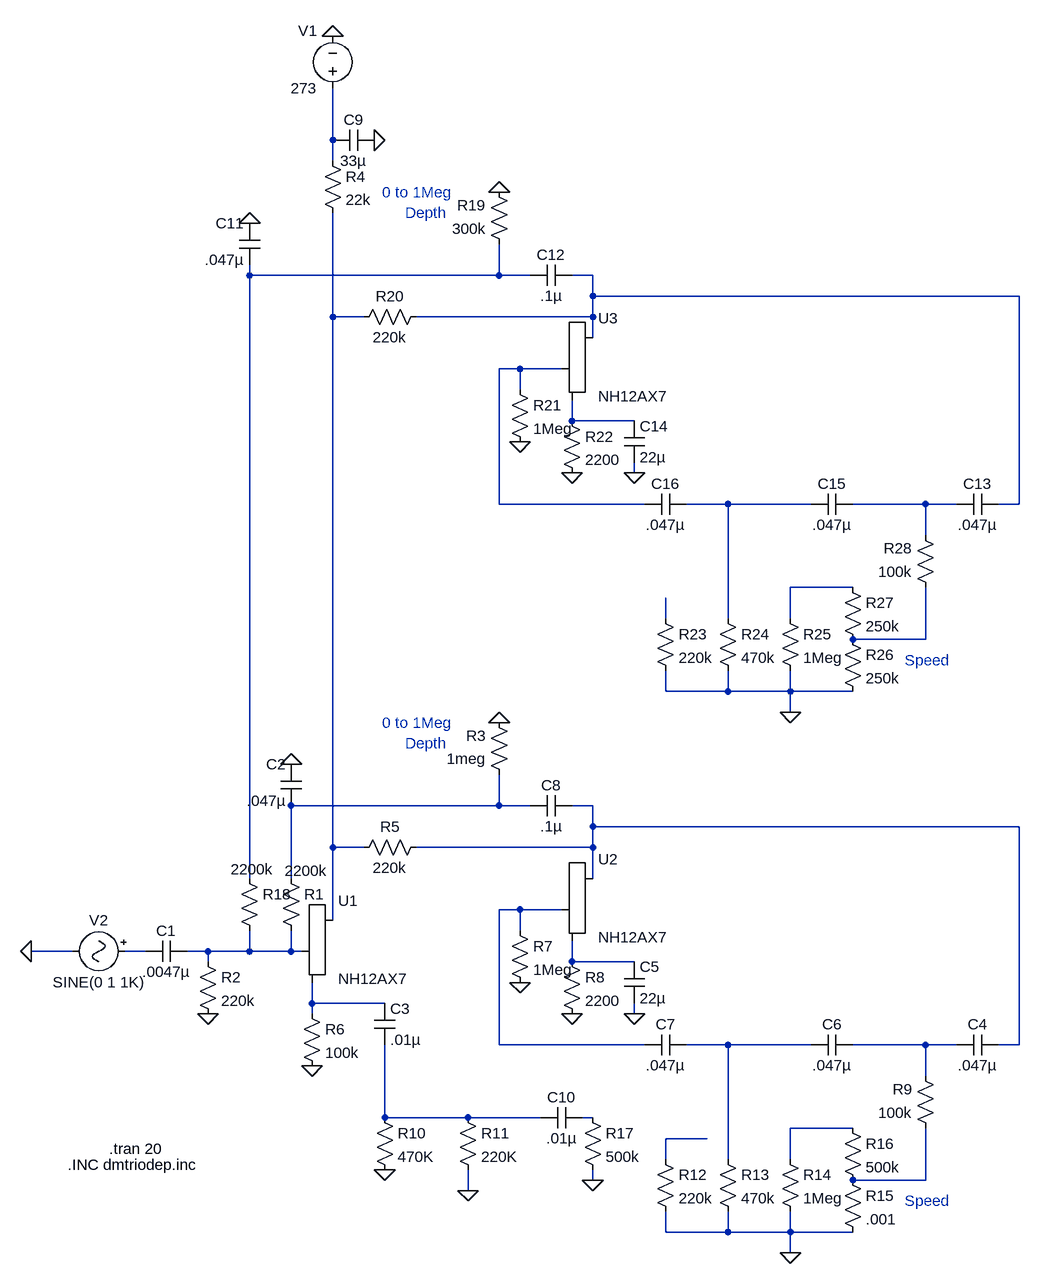
[diagram p0: schematic Matchless_Tremolo_double_tremolo.asc]
Matchless_Tremolo_double_tremolo.asc, the LTspice schematic file:
Version 4
SHEET 1 1108 696
WIRE 48 -1072 48 -1152
WIRE 48 -1040 48 -1072
WIRE -80 -864 -80 -880
WIRE 304 -864 304 -912
WIRE 304 -864 -80 -864
WIRE 352 -864 304 -864
WIRE 448 -864 416 -864
WIRE 448 -832 448 -864
WIRE 1104 -832 448 -832
WIRE 48 -800 48 -960
WIRE 96 -800 48 -800
WIRE 448 -800 448 -832
WIRE 448 -800 176 -800
WIRE 448 -768 448 -800
WIRE 336 -720 304 -720
WIRE 400 -720 336 -720
WIRE 336 -688 336 -720
WIRE 416 -640 416 -672
WIRE 512 -640 416 -640
WIRE 512 -560 512 -576
WIRE 304 -512 304 -720
WIRE 528 -512 304 -512
WIRE 656 -512 592 -512
WIRE 784 -512 656 -512
WIRE 960 -512 848 -512
WIRE 1008 -512 960 -512
WIRE 1104 -512 1104 -832
WIRE 1104 -512 1072 -512
WIRE 960 -464 960 -512
WIRE 848 -384 752 -384
WIRE 560 -336 560 -368
WIRE 656 -336 656 -512
WIRE 752 -336 752 -384
WIRE 960 -304 960 -384
WIRE 960 -304 848 -304
WIRE 560 -224 560 -256
WIRE 656 -224 656 -256
WIRE 656 -224 560 -224
WIRE 752 -224 752 -256
WIRE 752 -224 656 -224
WIRE 848 -224 752 -224
WIRE 752 -192 752 -224
WIRE 304 -48 304 -96
WIRE 304 -48 -16 -48
WIRE 352 -48 304 -48
WIRE 448 -48 416 -48
WIRE 448 -16 448 -48
WIRE 1104 -16 448 -16
WIRE 48 16 48 -800
WIRE 96 16 48 16
WIRE 448 16 448 -16
WIRE 448 16 176 16
WIRE -80 64 -80 -864
WIRE -16 64 -16 -48
WIRE 448 64 448 16
WIRE 336 112 304 112
WIRE 400 112 336 112
WIRE 48 128 48 16
WIRE 336 144 336 112
WIRE -352 176 -416 176
WIRE -240 176 -272 176
WIRE -144 176 -176 176
WIRE -80 176 -80 144
WIRE -80 176 -144 176
WIRE -16 176 -16 144
WIRE -16 176 -80 176
WIRE 0 176 -16 176
WIRE -144 192 -144 176
WIRE 416 192 416 160
WIRE 512 192 416 192
WIRE 16 256 16 224
WIRE 128 256 16 256
WIRE 16 272 16 256
WIRE 512 272 512 256
WIRE 304 320 304 112
WIRE 528 320 304 320
WIRE 656 320 592 320
WIRE 784 320 656 320
WIRE 960 320 848 320
WIRE 1008 320 960 320
WIRE 1104 320 1104 -16
WIRE 1104 320 1072 320
WIRE 960 368 960 320
WIRE 128 432 128 320
WIRE 256 432 128 432
WIRE 368 432 256 432
WIRE 448 432 432 432
WIRE 848 448 752 448
WIRE 624 464 560 464
WIRE 560 496 560 464
WIRE 656 496 656 320
WIRE 752 496 752 448
WIRE 448 528 448 512
WIRE 960 528 960 448
WIRE 960 528 848 528
WIRE 256 544 256 512
WIRE 560 608 560 576
WIRE 656 608 656 576
WIRE 656 608 560 608
WIRE 752 608 752 576
WIRE 752 608 656 608
WIRE 848 608 752 608
WIRE 752 640 752 608
FLAG 48 -1232 0
FLAG -144 272 0
FLAG -16 -112 0
FLAG 304 -176 0
FLAG 16 352 0
FLAG 512 272 0
FLAG 416 272 0
FLAG 128 512 0
FLAG 256 544 0
FLAG 336 224 0
FLAG -416 176 0
FLAG 112 -1072 0
FLAG 752 640 0
FLAG 448 528 0
FLAG -80 -944 0
FLAG 304 -992 0
FLAG 512 -560 0
FLAG 416 -560 0
FLAG 336 -608 0
FLAG 752 -192 0
SYMBOL voltage 48 -1136 R180
WINDOW 0 24 104 Left 0
WINDOW 3 24 16 Left 0
WINDOW 123 0 0 Left 0
WINDOW 39 0 0 Left 0
SYMATTR InstName V1
SYMATTR Value 273
SYMBOL cap -176 160 R90
WINDOW 0 0 32 VBottom 0
WINDOW 3 32 32 VTop 0
SYMATTR InstName C1
SYMATTR Value .0047µ
SYMBOL res -32 48 R0
WINDOW 3 6 4 Left 0
SYMATTR InstName R1
SYMATTR Value 2200k
SYMBOL res -160 176 R0
SYMATTR InstName R2
SYMATTR Value 220k
SYMBOL cap 0 -48 R180
WINDOW 0 24 64 Left 0
WINDOW 3 24 8 Left 0
SYMATTR InstName C2
SYMATTR Value .047µ
SYMBOL res 320 -80 R180
WINDOW 0 36 76 Left 0
WINDOW 3 36 40 Left 0
SYMATTR InstName R3
SYMATTR Value 1meg
SYMBOL Misc\\triode 48 176 R0
SYMATTR InstName U1
SYMATTR Value NH12AX7
SYMBOL res 192 0 R90
WINDOW 0 0 56 VBottom 0
WINDOW 3 32 56 VTop 0
SYMATTR InstName R5
SYMATTR Value 220k
SYMBOL res 0 256 R0
SYMATTR InstName R6
SYMATTR Value 100k
SYMBOL cap 112 256 R0
SYMATTR InstName C3
SYMATTR Value .01µ
SYMBOL Misc\\triode 448 112 R0
SYMATTR InstName U2
SYMATTR Value NH12AX7
SYMBOL res 320 128 R0
SYMATTR InstName R7
SYMATTR Value 1Meg
SYMBOL cap 1072 304 R90
WINDOW 0 0 32 VBottom 0
WINDOW 3 32 32 VTop 0
SYMATTR InstName C4
SYMATTR Value .047µ
SYMBOL cap 496 192 R0
SYMATTR InstName C5
SYMATTR Value 22µ
SYMBOL res 400 176 R0
SYMATTR InstName R8
SYMATTR Value 2200
SYMBOL cap 848 304 R90
WINDOW 0 0 32 VBottom 0
WINDOW 3 32 32 VTop 0
SYMATTR InstName C6
SYMATTR Value .047µ
SYMBOL res 976 464 R180
WINDOW 0 36 76 Left 0
WINDOW 3 36 40 Left 0
SYMATTR InstName R9
SYMATTR Value 100k
SYMBOL cap 592 304 R90
WINDOW 0 0 32 VBottom 0
WINDOW 3 32 32 VTop 0
SYMATTR InstName C7
SYMATTR Value .047µ
SYMBOL res 112 416 R0
SYMATTR InstName R10
SYMATTR Value 470K
SYMBOL res 240 416 R0
SYMATTR InstName R11
SYMATTR Value 220K
SYMBOL res 544 480 R0
SYMATTR InstName R12
SYMATTR Value 220k
SYMBOL res 640 480 R0
SYMATTR InstName R13
SYMATTR Value 470k
SYMBOL res 736 480 R0
SYMATTR InstName R14
SYMATTR Value 1Meg
SYMBOL res 832 512 R0
SYMATTR InstName R15
SYMATTR Value .001
SYMBOL res 832 432 R0
SYMATTR InstName R16
SYMATTR Value 500k
SYMBOL cap 416 -64 R90
WINDOW 0 0 32 VBottom 0
WINDOW 3 32 32 VTop 0
SYMATTR InstName C8
SYMATTR Value .1µ
SYMBOL res 32 -1056 R0
SYMATTR InstName R4
SYMATTR Value 22k
SYMBOL cap 112 -1088 R90
WINDOW 0 0 32 VBottom 0
WINDOW 3 32 32 VTop 0
SYMATTR InstName C9
SYMATTR Value 33µ
SYMBOL Misc\\signal -256 176 R90
WINDOW 0 -32 56 VBottom 0
WINDOW 3 32 56 VTop 0
SYMATTR InstName V2
SYMBOL cap 432 416 R90
WINDOW 0 0 32 VBottom 0
WINDOW 3 32 32 VTop 0
SYMATTR InstName C10
SYMATTR Value .01µ
SYMBOL res 432 416 R0
SYMATTR InstName R17
SYMATTR Value 500k
SYMBOL res -96 48 R0
WINDOW 3 -13 2 Left 0
SYMATTR InstName R18
SYMATTR Value 2200k
SYMBOL cap -64 -880 R180
WINDOW 0 24 64 Left 0
WINDOW 3 24 8 Left 0
SYMATTR InstName C11
SYMATTR Value .047µ
SYMBOL res 320 -896 R180
WINDOW 0 36 76 Left 0
WINDOW 3 36 40 Left 0
SYMATTR InstName R19
SYMATTR Value 300k
SYMBOL res 192 -816 R90
WINDOW 0 0 56 VBottom 0
WINDOW 3 32 56 VTop 0
SYMATTR InstName R20
SYMATTR Value 220k
SYMBOL cap 416 -880 R90
WINDOW 0 0 32 VBottom 0
WINDOW 3 32 32 VTop 0
SYMATTR InstName C12
SYMATTR Value .1µ
SYMBOL Misc\\triode 448 -720 R0
SYMATTR InstName U3
SYMATTR Value NH12AX7
SYMBOL res 320 -704 R0
SYMATTR InstName R21
SYMATTR Value 1Meg
SYMBOL cap 1072 -528 R90
WINDOW 0 0 32 VBottom 0
WINDOW 3 32 32 VTop 0
SYMATTR InstName C13
SYMATTR Value .047µ
SYMBOL cap 496 -640 R0
SYMATTR InstName C14
SYMATTR Value 22µ
SYMBOL res 400 -656 R0
SYMATTR InstName R22
SYMATTR Value 2200
SYMBOL cap 848 -528 R90
WINDOW 0 0 32 VBottom 0
WINDOW 3 32 32 VTop 0
SYMATTR InstName C15
SYMATTR Value .047µ
SYMBOL cap 592 -528 R90
WINDOW 0 0 32 VBottom 0
WINDOW 3 32 32 VTop 0
SYMATTR InstName C16
SYMATTR Value .047µ
SYMBOL res 544 -352 R0
SYMATTR InstName R23
SYMATTR Value 220k
SYMBOL res 640 -352 R0
SYMATTR InstName R24
SYMATTR Value 470k
SYMBOL res 736 -352 R0
SYMATTR InstName R25
SYMATTR Value 1Meg
SYMBOL res 832 -320 R0
SYMATTR InstName R26
SYMATTR Value 250k
SYMBOL res 832 -400 R0
SYMATTR InstName R27
SYMATTR Value 250k
SYMBOL res 976 -368 R180
WINDOW 0 36 76 Left 0
WINDOW 3 36 40 Left 0
SYMATTR InstName R28
SYMATTR Value 100k
TEXT 224 -144 Right 0 ;Depth
TEXT 928 560 Left 0 ;Speed
TEXT -360 504 Left 0 !.INC dmtriodep.inc
TEXT -296 480 Left 0 !.tran 20
TEXT 232 -176 Right 0 ;0 to 1Meg
TEXT 224 -960 Right 0 ;Depth
TEXT 232 -992 Right 0 ;0 to 1Meg
TEXT 928 -272 Left 0 ;Speed

The netlist it stands for:
* Matchless_Tremolo_double_tremolo.asc
V1 N001 0 273
C1 N016 N015 .0047µ
R1 N012 N016 2200k
R2 N016 0 220k
C2 N012 0 .047µ
R3 N012 0 1meg
XU1 N004 N016 N018 NH12AX7
R5 N013 N004 220k
R6 N018 0 100k
C3 N018 N021 .01µ
XU2 N013 N014 N017 NH12AX7
R7 N014 0 1Meg
C4 N013 N020 .047µ
C5 N017 0 22µ
R8 N017 0 2200
C6 N020 N019 .047µ
R9 N025 N020 100k
C7 N019 N014 .047µ
R10 N021 0 470K
R11 N021 0 220K
R12 N024 0 220k
R13 N019 0 470k
R14 N023 0 1Meg
R15 N025 0 .001
R16 N023 N025 500k
C8 N013 N012 .1µ
R4 N001 N004 22k
C9 0 N001 33µ
V2 N015 0 SINE(0 1 1K)
C10 N022 N021 .01µ
R17 N022 0 500k
R18 N002 N016 2200k
C11 N002 0 .047µ
R19 N002 0 300k
R20 N003 N004 220k
C12 N003 N002 .1µ
XU3 N003 N005 N006 NH12AX7
R21 N005 0 1Meg
C13 N003 N008 .047µ
C14 N006 0 22µ
R22 N006 0 2200
C15 N008 N007 .047µ
C16 N007 N005 .047µ
R23 N010 0 220k
R24 N007 0 470k
R25 N009 0 1Meg
R26 N011 0 250k
R27 N009 N011 250k
R28 N011 N008 100k
* Depth
* Speed
.INC dmtriodep.inc
.tran 20
* 0 to 1Meg
* Depth
* 0 to 1Meg
* Speed
.backanno
.end